# Altium schematic sheet PM-1_PDB.SchDoc
size A3; Organization: Altium Limited; Address1: L3, 12a Rodborough Rd; Address2: Frenchs Forest; Address3: NSW; Address4: Australia 2086
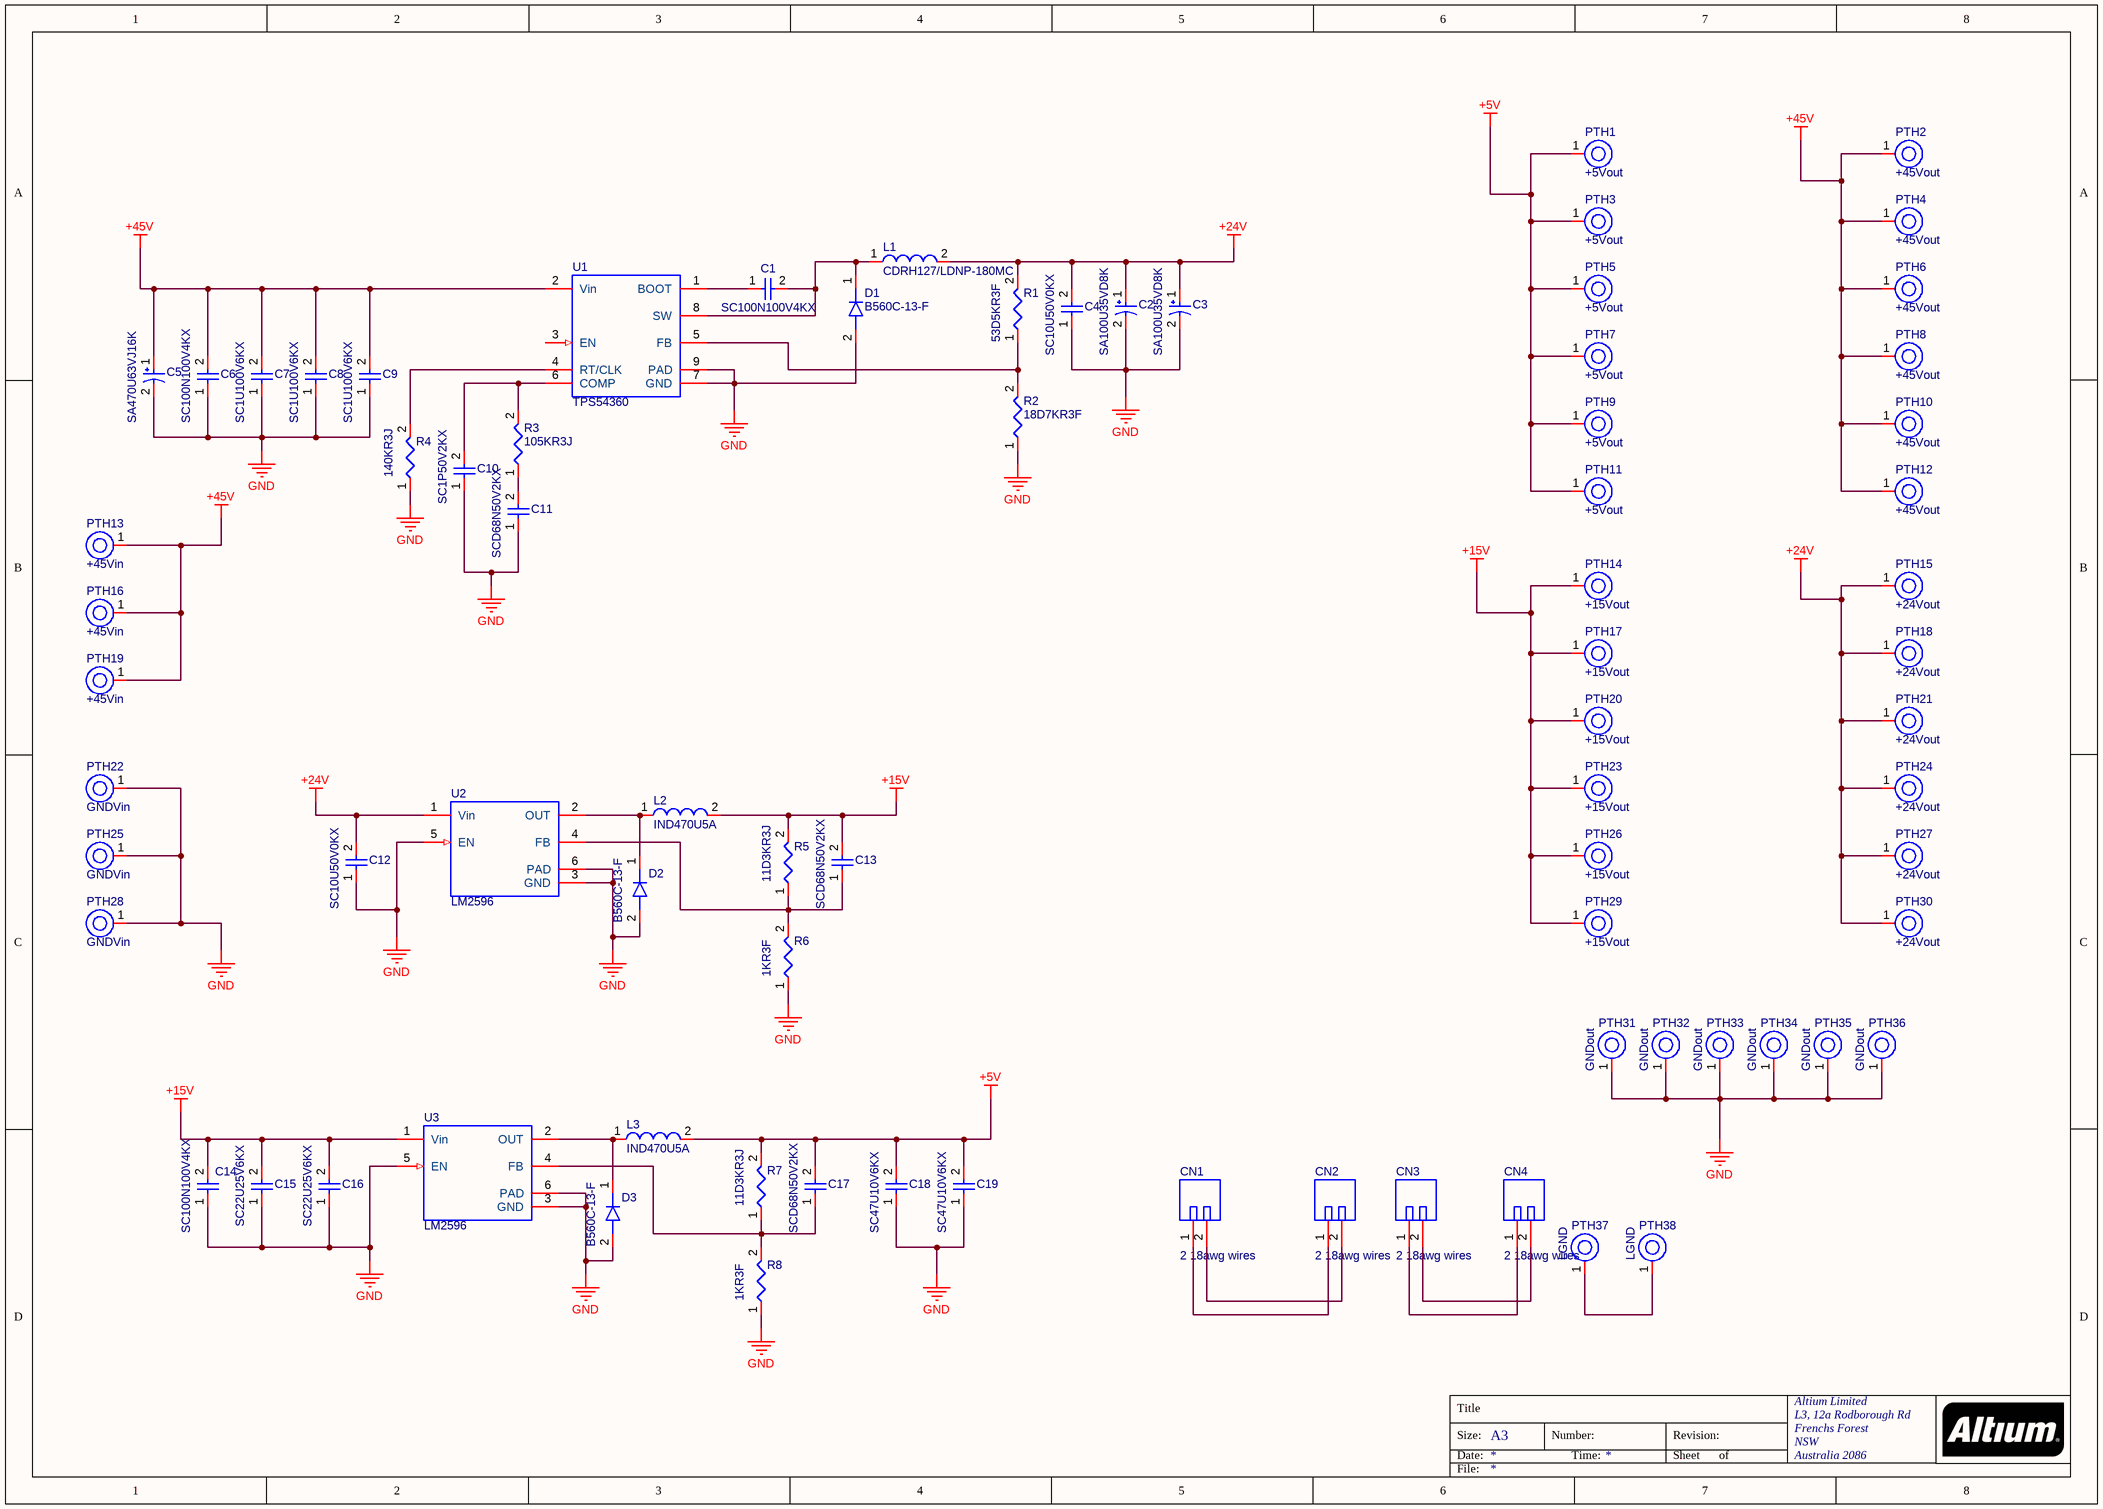
[diagram p0: PM-1_PDB.SchDoc]

## Parts
C1  SC100N100V4KX  [CAPC0402(1005)60_L]
C2  SA100U35VD8K  [CAPAE(D8)7666X80L]
C3  SA100U35VD8K  [CAPAE(D8)7666X80L]
C4  SC10U50V0KX  [CAPC3225X27L]
C5  SA470U63VJ16K  [CAPAE184170X170L]
C6  SC100N100V4KX  [CAPC0402(1005)60_L]
C7  SC1U100V6KX  [CAPC1206(3216)]
C8  SC1U100V6KX  [CAPC1206(3216)]
C9  SC1U100V6KX  [CAPC1206(3216)]
C10  SC1P50V2KX  [CAPC0402(1005)60_L]
C11  SCD68N50V2KX  [CAPC0402(1005)60_L]
C12  SC10U50V0KX  [CAPC3225X27L]
C13  SCD68N50V2KX  [CAPC0402(1005)60_L]
C14  SC100N100V4KX  [CAPC0402(1005)60_L]
C15  SC22U25V6KX  [CAPC1206(3216)]
C16  SC22U25V6KX  [CAPC1206(3216)]
C17  SCD68N50V2KX  [CAPC0402(1005)60_L]
C18  SC47U10V6KX  [CAPC1206(3216)]
C19  SC47U10V6KX  [CAPC1206(3216)]
CN1  2 18awg wires  [2PHEADERS-2D54]  (no BOM)
CN2  2 18awg wires  [2PHEADERS-2D54]  (no BOM)
CN3  2 18awg wires  [2PHEADERS-2D54]  (no BOM)
CN4  2 18awg wires  [2PHEADERS-2D54]  (no BOM)
D1  B560C-13-F  [SMC]
D2  B560C-13-F  [SMC]
D3  B560C-13-F  [SMC]
L1  CDRH127/LDNP-180MC  [INDP120120X80L]
L2  IND470U5A  [INDP120120X80L]
L3  IND470U5A  [INDP120120X80L]
PTH1  +5Vout  [POWERHOLE-LP]  (no BOM)
PTH2  +45Vout  [POWERHOLE]  (no BOM)
PTH3  +5Vout  [POWERHOLE-LP]  (no BOM)
PTH4  +45Vout  [POWERHOLE]  (no BOM)
PTH5  +5Vout  [POWERHOLE-LP]  (no BOM)
PTH6  +45Vout  [POWERHOLE]  (no BOM)
PTH7  +5Vout  [POWERHOLE-LP]  (no BOM)
PTH8  +45Vout  [POWERHOLE]  (no BOM)
PTH9  +5Vout  [POWERHOLE-LP]  (no BOM)
PTH10  +45Vout  [POWERHOLE]  (no BOM)
PTH11  +5Vout  [POWERHOLE-LP]  (no BOM)
PTH12  +45Vout  [POWERHOLE]  (no BOM)
PTH13  +45Vin  [POWERHOLE]  (no BOM)
PTH14  +15Vout  [POWERHOLE-LP]  (no BOM)
PTH15  +24Vout  [POWERHOLE]  (no BOM)
PTH16  +45Vin  [POWERHOLE]  (no BOM)
PTH17  +15Vout  [POWERHOLE-LP]  (no BOM)
PTH18  +24Vout  [POWERHOLE]  (no BOM)
PTH19  +45Vin  [POWERHOLE]  (no BOM)
PTH20  +15Vout  [POWERHOLE-LP]  (no BOM)
PTH21  +24Vout  [POWERHOLE]  (no BOM)
PTH22  GNDVin  [POWERHOLE]  (no BOM)
PTH23  +15Vout  [POWERHOLE-LP]  (no BOM)
PTH24  +24Vout  [POWERHOLE]  (no BOM)
PTH25  GNDVin  [POWERHOLE]  (no BOM)
PTH26  +15Vout  [POWERHOLE-LP]  (no BOM)
PTH27  +24Vout  [POWERHOLE]  (no BOM)
PTH28  GNDVin  [POWERHOLE]  (no BOM)
PTH29  +15Vout  [POWERHOLE-LP]  (no BOM)
PTH30  +24Vout  [POWERHOLE]  (no BOM)
PTH31  GNDout  [POWERHOLE]  (no BOM)
PTH32  GNDout  [POWERHOLE]  (no BOM)
PTH33  GNDout  [POWERHOLE]  (no BOM)
PTH34  GNDout  [POWERHOLE]  (no BOM)
PTH35  GNDout  [POWERHOLE]  (no BOM)
PTH36  GNDout  [POWERHOLE]  (no BOM)
PTH37  LGND  [POWERHOLE-LP]  (no BOM)
PTH38  LGND  [POWERHOLE-LP]  (no BOM)
R1  53D5KR3F  [RESC0603(1608)_L]
R2  18D7KR3F  [RESC0603(1608)_L]
R3  105KR3J  [RESC0603(1608)_L]
R4  140KR3J  [RESC0603(1608)_L]
R5  11D3KR3J  [RESC0603(1608)_L]
R6  1KR3F  [RESC0603(1608)_L]
R7  11D3KR3J  [RESC0603(1608)_L]
R8  1KR3F  [RESC0603(1608)_L]
U1  TPS54360  [POWERSO8]
U2  LM2596  [D2PAK]
U3  LM2596  [D2PAK]

## Nets
+5V: C17.2 C18.2 C19.2 L3.2 PTH1.1(H1) PTH3.1(H1) PTH5.1(H1) PTH7.1(H1) PTH9.1(H1) PTH11.1(H1) R7.2
+15V: C13.2 C14.2 C15.2 C16.2 L2.2 PTH14.1(H1) PTH17.1(H1) PTH20.1(H1) PTH23.1(H1) PTH26.1(H1) PTH29.1(H1) R5.2 U3.1(Vin)
+24V: C2.1 C3.1 C4.2 C12.2 L1.2 PTH15.1(H1) PTH18.1(H1) PTH21.1(H1) PTH24.1(H1) PTH27.1(H1) PTH30.1(H1) R1.2 U2.1(Vin)
+45V: C5.1 C6.2 C7.2 C8.2 C9.2 PTH2.1(H1) PTH4.1(H1) PTH6.1(H1) PTH8.1(H1) PTH10.1(H1) PTH12.1(H1) PTH13.1(H1) PTH16.1(H1) PTH19.1(H1) U1.2(Vin)
GND: C2.2 C3.2 C4.1 C5.2 C6.1 C7.1 C8.1 C9.1 C10.1 C11.1 C12.1 C14.1 C15.1 C16.1 C18.1 C19.1 D1.2(A) D2.2(A) D3.2(A) PTH22.1(H1) PTH25.1(H1) PTH28.1(H1) PTH31.1(H1) PTH32.1(H1) PTH33.1(H1) PTH34.1(H1) PTH35.1(H1) PTH36.1(H1) R2.1 R4.1 R6.1 R8.1 U1.7(GND) U1.9(PAD) U2.3(GND) U2.5(EN) U2.6(PAD) U3.3(GND) U3.5(EN) U3.6(PAD)
NetC1_1: C1.1 U1.1(BOOT)
NetC1_2: C1.2 D1.1(K) L1.1 U1.8(SW)
NetC10_2: C10.2 R3.2 U1.6(COMP)
NetC11_2: C11.2 R3.1
NetC13_1: C13.1 R5.1 R6.2 U2.4(FB)
NetC17_1: C17.1 R7.1 R8.2 U3.4(FB)
NetCN1_1: CN1.1 CN2.1
NetCN1_2: CN1.2 CN2.2
NetCN3_1: CN3.1 CN4.1
NetCN3_2: CN3.2 CN4.2
NetD2_1: D2.1(K) L2.1 U2.2(OUT)
NetD3_1: D3.1(K) L3.1 U3.2(OUT)
NetPTH37_1: PTH37.1(H1) PTH38.1(H1)
NetR1_1: R1.1 R2.2 U1.5(FB)
NetR4_2: R4.2 U1.4(RT/CLK)

Not connected (* = marked no-connect by the designer): U1 3(EN)

## Notes on the sheet
- Title
- Size:
- Date:
- A3
- Number:
- Time:
- Revision:
- Sheet
- of
- File:

## Library data of the parts
C1 C6 C14 = CAP(0805)100nF100V: CAP 100nF 100V ±10% 0805(1610 Metric) Thickness 1mm SMD
C2 C3 = CAP(D8)100UF35V: CAP 100uF 35V ±10% D8 Thickness 7.7mm SMD
C4 C12 = CAP(1210)10UF50V: CAP 10uF 50V ±10% 1210(3225 Metric) Thickness 1.7mm SMD
C5 = CAP(J16)470UF63V: EEVFK1J471M CAP 470uF 63V ±10% J16 Thickness 17mm SMD
C7-C9 = CAP(1206)1UF100V: CAP 1uF 100V ±10% 1206(3216 Metric) Thickness 1.8mm SMD
C10 = CAP(0402)1pF50V: CAP 1pF 50V ±10% 0402 (1005 Metric) Thickness 0.6mm SMD
C11 C13 C17 = CAP(0402)680pF50V: CAP 680pF 50V ±10% 0402 (1005 Metric) Thickness 0.6mm SMD
C15 C16 = CAP(1206)22UF25V: CAP 22uF 25V ±10% 1206(3216 Metric) Thickness 1.8mm SMD
C18 C19 = CAP(1206)47UF10V: CAP 47uF 10V ±10% 1206(3216 Metric) Thickness 1.8mm SMD
CN1-CN4 = 2PIN-CN: 2 holes for 18awg wire; Manufacturer: JST; Datasheet URL: http://www.jst-mfg.com/product/pdf/eng/eGH.pdf; Package Reference: JST-BM04B-GHS-TBT
D1-D3 = DIOD-B560C: 5.0A SURFACE MOUNT SCHOTTKY BARRIER RECTIFIER; Manufacturer: Rohm; Package Reference: ROHM-1SS400CSFH; Datasheet URL: https://www.rohm.com/datasheet/1SS400CSFH/1ss400csfht2ra-e
L1 = CDRH127: Inductor: SMD, 18 uHn, 5.1 A
L2 L3 = IND470U5A: Inductor: SMD, 47 uHn, 5 A
PTH1 PTH3 PTH5 PTH7 PTH9 PTH11 PTH14 PTH17 PTH20 PTH23 PTH26 PTH29 PTH37 PTH38 = PTH-1D2M: 1.2mm hole 2mm pad; Pad diameter (mm): 5; Hole diameter (mm): 2.5
PTH2 PTH4 PTH6 PTH8 PTH10 PTH12 PTH13 PTH15 PTH16 PTH18 PTH19 PTH21 PTH22 PTH24 PTH25 PTH27 PTH28 PTH30-PTH36 = PTH-2M: 2mm hole 3.5mm pad; Pad diameter (mm): 5; Hole diameter (mm): 2.5
R1 = RES0(0603)_53D5K: 53.5K 0.1W 1% 0603 (1608 Metric)  SMD
R2 = RES0(0603)_1D8K: 18.7K 0.1W 1% 0603 (1608 Metric)  SMD
R3 = RES0(0603)_105K: 105K 0.1W 5% 0603 (1608 Metric)  SMD
R4 = RES0(0603)_140K: 140K 0.1W 5% 0603 (1608 Metric)  SMD
R5 R7 = RES0(0603)_11D3K: 11.3K 0.1W 5% 0603 (1608 Metric)  SMD
R6 R8 = RES0(0603)_1K: 1K 0.1W 1% 0603 (1608 Metric)  SMD
U1 = TPS54360: 60 V Input, 3.5 A, Step Down DC-DC Converter
U2 U3 = LM2596: 4 V Input, 3 A, Step Down DC-DC Converter